# Altium schematic sheet [12]-CAMERA_POWER.SchDoc
size A4
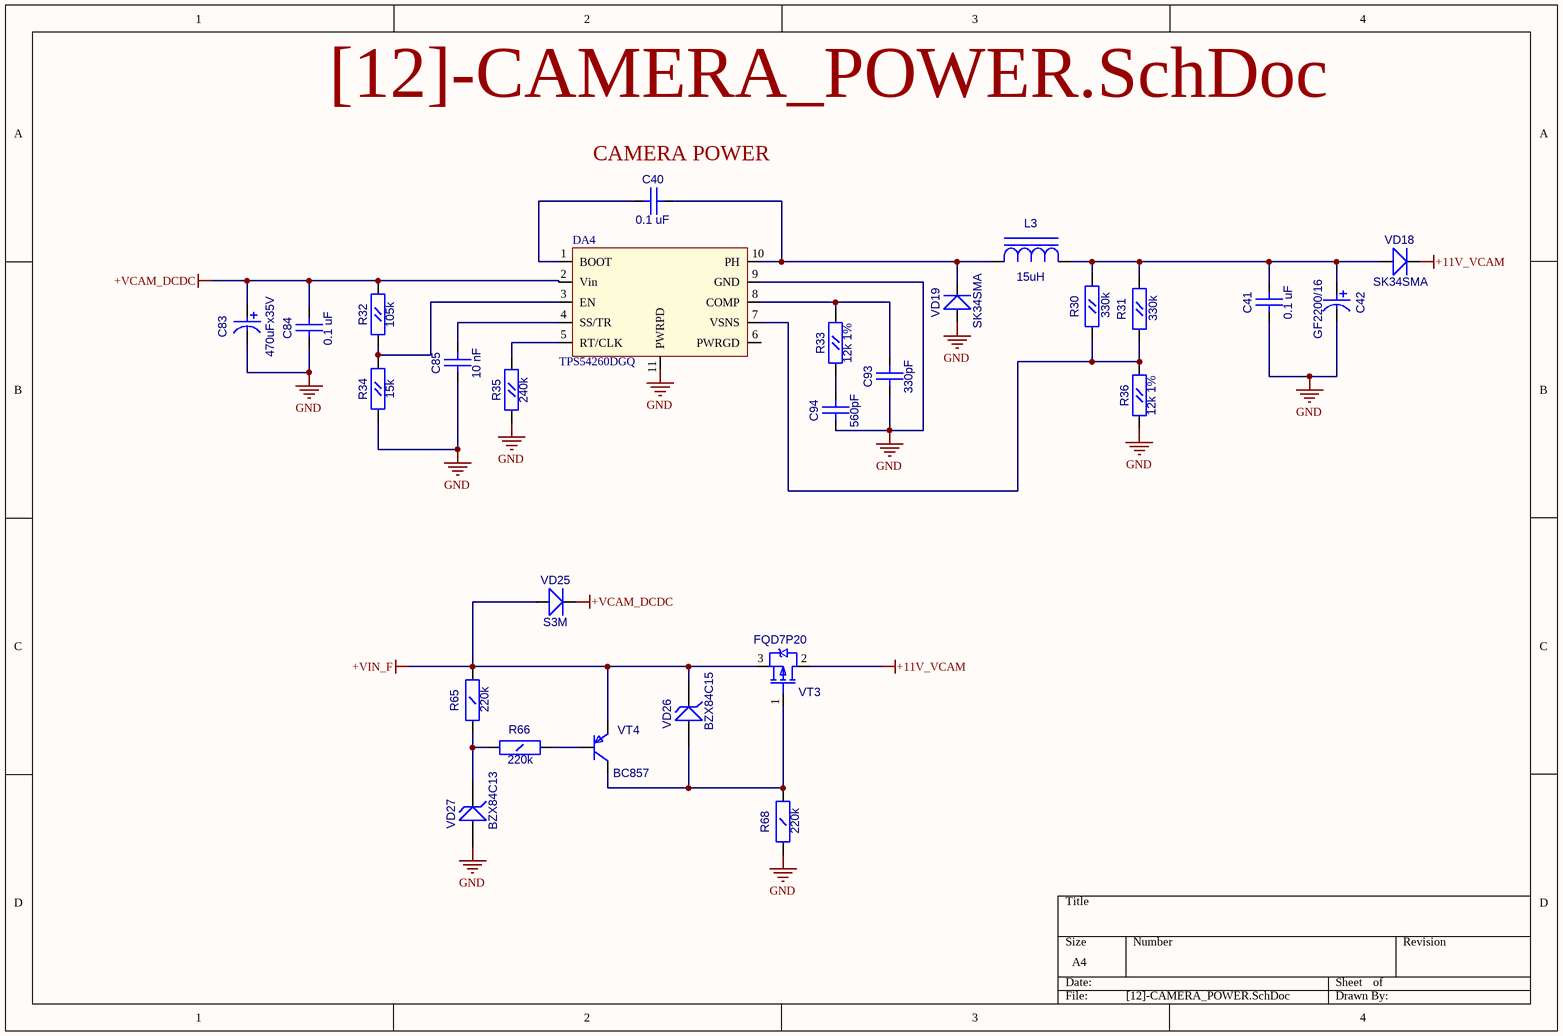
[diagram p0: [12]-CAMERA_POWER.SchDoc]

## Parts
C40  0.1 uF  [CC0603]
C41  0.1 uF  [CC0603]
C42  GF2200/16  [CAP10x20_FLAT]
C83  470uFx35V  [CC16X10_CAP0.5(1)(Primary)]
C84  0.1 uF  [CC0603]
C85  10 nF  [CC0603]
C93  330pF  [CC0603]
C94  560pF  [CC0603]
DA4  TPS54260DGQ  [S-PDSO-G10]
L3  15uH  [SDR0805]
R30  330k  [RC0603]
R31  330k  [RC0603]
R32  105k  [RC0603]
R33  12k 1%  [RC0603]
R34  15k  [RC0603]
R35  240k  [RC0603]
R36  12k 1%  [RC0603]
R65  220k  [RC1206]
R66  220k  [RC1206]
R68  220k  [RC1206]
VD18  SK34SMA  [SMA]
VD19  SK34SMA  [SMA]
VD25  S3M  [SMC]
VD26  BZX84C15  [SOT-23(123)]
VD27  BZX84C13  [SOT-23(123)]
VT3  FQD7P20  [D-PAK(TO-252AA)]
VT4  BC857  [SOT-23(123)]

## Nets
+11V_VCAM: VD18.2(K) VT3.2(D)
+VCAM_DCDC: C83.2 C84.1(A) DA4.2(Vin) R32.2(B) VD25.2(K)
+VIN_F: R65.2(B) VD25.1(A) VD26.3(K) VT3.3(S) VT4.2(E)
GND: C41.2(B) C42.1 C83.1 C84.2(B) C85.2(B) C93.2(B) C94.2(B) DA4.9(GND) DA4.11(PWRPD) R34.1(A) R35.1(A) R36.1(A) R68.1(A) VD19.1(A) VD27.1(A)
NetC40_1: C40.1(A) DA4.10(PH) L3.1(C) VD19.2(K)
NetC40_2: C40.2(B) DA4.1(BOOT)
NetC41_1: C41.1(A) C42.2 L3.2(A) R30.2(B) R31.2(B) VD18.1(A)
NetC85_1: C85.1(A) DA4.4(SS/TR)
NetC93_1: C93.1(A) DA4.8(COMP) R33.2(B)
NetC94_1: C94.1(A) R33.1(A)
NetDA4_3: DA4.3(EN) R32.1(A) R34.2(B)
NetDA4_5: DA4.5(RT/CLK) R35.2(B)
NetDA4_7: DA4.7(VSNS) R30.1(A) R31.1(A) R36.2(B)
NetR65_1: R65.1(A) R66.1(A) VD27.3(K)
NetR66_2: R66.2(B) VT4.1(B)
NetR68_2: R68.2(B) VD26.1(A) VT3.1(G) VT4.3(C)

Not connected (* = marked no-connect by the designer): DA4 6(PWRGD)

## Notes on the sheet
- (near C40) CAMERA POWER

## Library data of the parts
C40 C41 C84 C85 C93 C94 = CC0603
  C40 C41 C84: Value: 0.1 uF
  C85: Value: 10 nF
  C93: Value: 330pF
  C94: Value: 560pF
C42 = CAP_10mm: Radial capacitor; Value: GF2200/16
C83 = CAP0.5(1): Value: 470uFx35V
L3 = SDR0805: Value: 15uH
R30-R36 = RC0603
  R30 R31: Value: 330k
  R32: Value: 105k
  R33 R36: Value: 12k 1%
  R34: Value: 15k
  R35: Value: 240k
R65 R66 R68 = RC1206: Value: 220k
VD18 VD19 = SK34SMA: Schottky Rectifier; Value: {Value}
VD25 = S3A: Schottky Rectifier; Value: S3M
VD26 VD27 = BZX84: Zener Voltage Regulator Diode
  VD26: Value: BZX84C15
  VD27: Value: BZX84C13
VT3 = IRFR9220: HEXFET Power MOSFET; OriginalName: IRLML5103; ComponentField7: Published 8-Jun-2000; Value: FQD7P20
VT4 = BC857B: PNP 100ma transistor; OriginalName: BC846BLT1; ComponentField7: Published 29-Sep-2000; Value: BC857